# EasyEDA schematic Vitulus_mower_control_2021-01-18.json
TITLE: Sheet_1; REV: 1.0; Date: 2020-12-13; Sheet: 1/1; Drawn By: robert.lacina; Company: LACINA.DEV
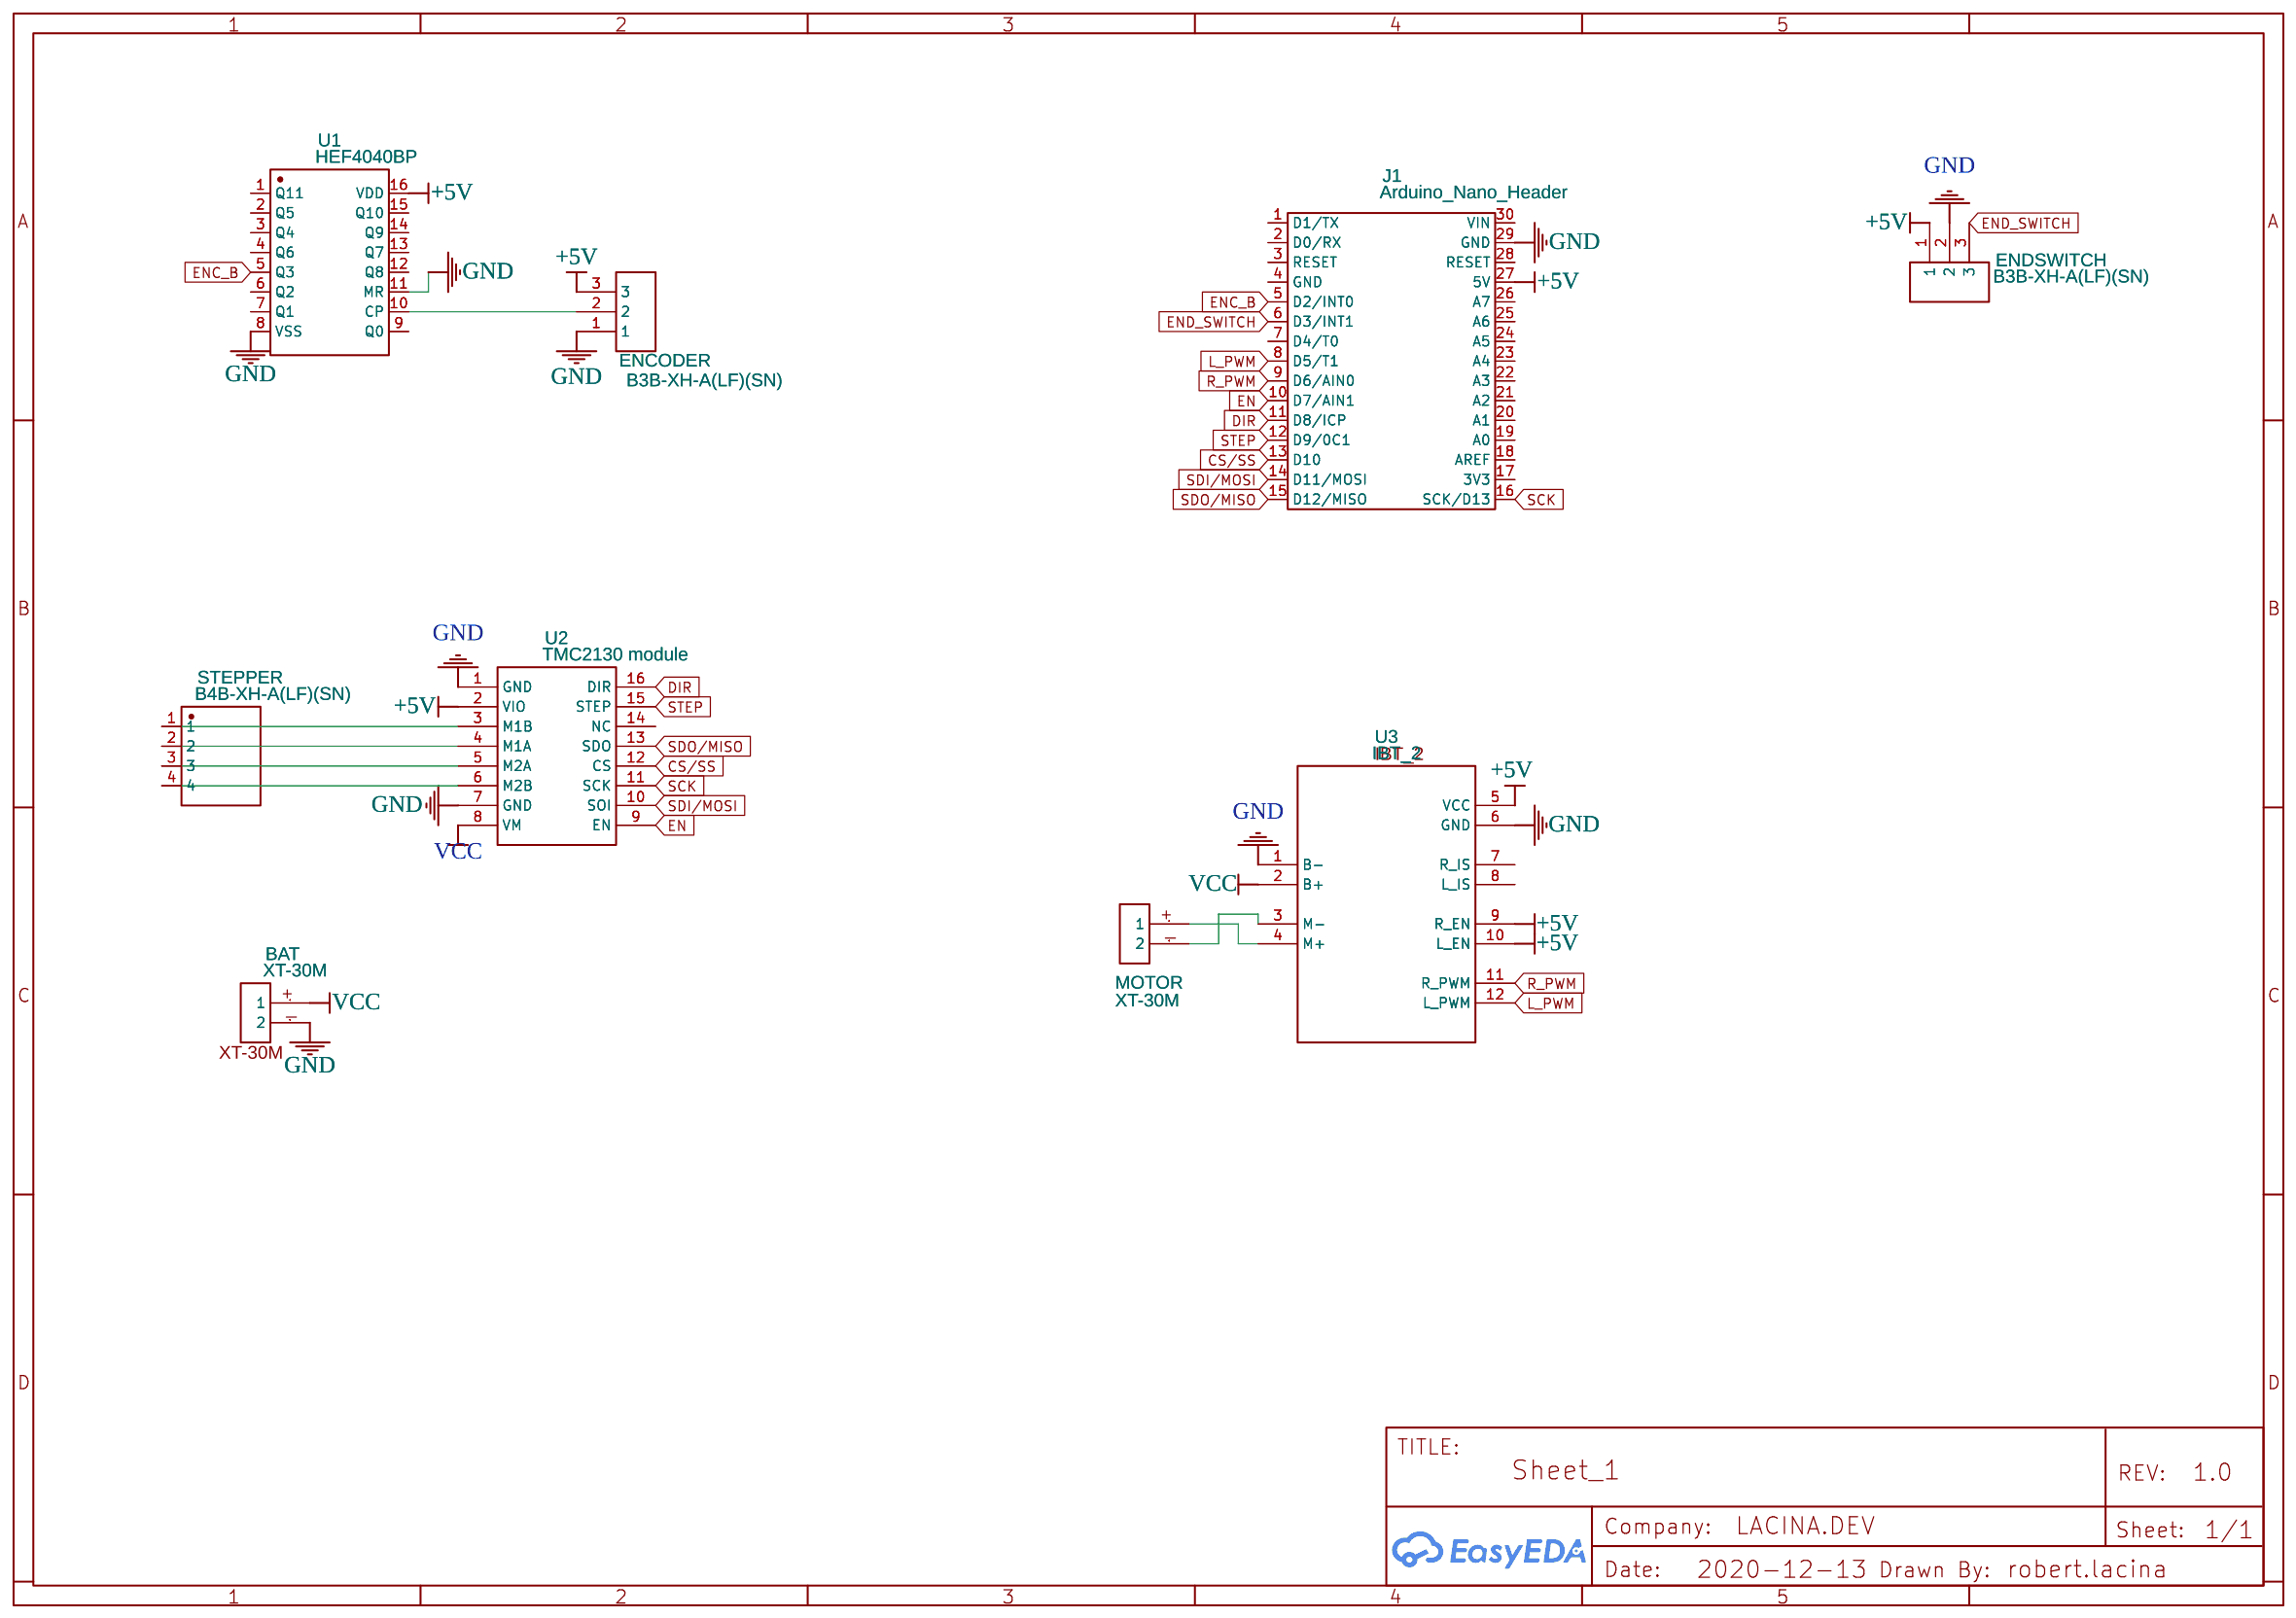
[diagram p0: schematic sheet]

## Parts
BAT  XT-30M  [XT-30M]
ENCODER  B3B-XH-A(LF)(SN)  [CONN-TH_3P-P2.50_B3B-XH-A(LF)(SN)]
ENDSWITCH  B3B-XH-A(LF)(SN)  [CONN-TH_3P-P2.50_B3B-XH-A(LF)(SN)]
J1  Arduino_Nano_Header  [DIP-30_L43.18-W15.24-ARDUINONANO]
MOTOR  XT-30M  [XT-30M]
STEPPER  B4B-XH-A(LF)(SN)  [CONN-TH_B4B-XH-A (LF)(SN)]
U1  HEF4040BP  [DIP16]
U2  TMC2130 module  [TMC2130]
U3  IBT_2  [IBT_2]

## Library data of the parts
BAT = XT-30M: Contributor: rmillsap; Package Display: Yes
ENCODER ENDSWITCH = B3B-XH-A(LF)(SN): Supplier: LCSC; Supplier Part: C144394; Manufacturer: JST Sales America; Contributor: LCSC
J1 = Arduino_Nano_Header
MOTOR = XT-30M: Contributor: rmillsap
STEPPER = B4B-XH-A(LF)(SN): Supplier: LCSC; Supplier Part: C144395; Manufacturer: JST Sales America; Contributor: LCSC
U1 = HEF4040BP
U2 = TMC2130 module: Contributor: ProBoDiS
U3 = IBT_2: Contributor: TrikerDK

## Nets
+5V: ENCODER.3 ENDSWITCH.1 J1.27(5V) U1.16(VDD) U2.2(VIO) U3.5(VCC) U3.9(R_EN) U3.10(L_EN)
GND: BAT.2 ENCODER.1 ENDSWITCH.2 J1.29(GND) U1.8(VSS) U1.11(MR) U2.1(GND) U2.7(GND) U3.1(B-) U3.6(GND)
VCC: BAT.1 U2.8(VM) U3.2(B+)
CS/SS: J1.13(D10) U2.12(CS)
DIR: J1.11(D8/ICP) U2.16(DIR)
EN: J1.10(D7/AIN1) U2.9(EN)
ENC_B: J1.5(D2/INT0) U1.5(Q3)
END_SWITCH: ENDSWITCH.3 J1.6(D3/INT1)
L_PWM: J1.8(D5/T1) U3.12(L_PWM)
R_PWM: J1.9(D6/AIN0) U3.11(R_PWM)
SCK: J1.16(SCK/D13) U2.11(SCK)
SDI/MOSI: J1.14(D11/MOSI) U2.10(SOI)
SDO/MISO: J1.15(D12/MISO) U2.13(SDO)
STEP: J1.12(D9/0C1) U2.15(STEP)
Net-(ENCODER-2): ENCODER.2 U1.10(CP)
Net-(MOTOR-1): MOTOR.1 U3.4(M+)
Net-(MOTOR-2): MOTOR.2 U3.3(M-)
Net-(STEPPER-1): STEPPER.1 U2.3(M1B)
Net-(STEPPER-2): STEPPER.2 U2.4(M1A)
Net-(STEPPER-3): STEPPER.3 U2.5(M2A)
Net-(STEPPER-4): STEPPER.4 U2.6(M2B)

Not connected (* = marked no-connect by the designer): J1 1(D1/TX) 2(D0/RX) 3(RESET) 4(GND) 7(D4/T0) 17(3V3) 18(AREF) 19(A0) 20(A1) 21(A2) 22(A3) 23(A4) 24(A5) 25(A6) 26(A7) 28(RESET) 30(VIN); U1 1(Q11) 2(Q5) 3(Q4) 4(Q6) 6(Q2) 7(Q1) 9(Q0) 12(Q8) 13(Q7) 14(Q9) 15(Q10); U2 14(NC); U3 7(R_IS) 8(L_IS)
